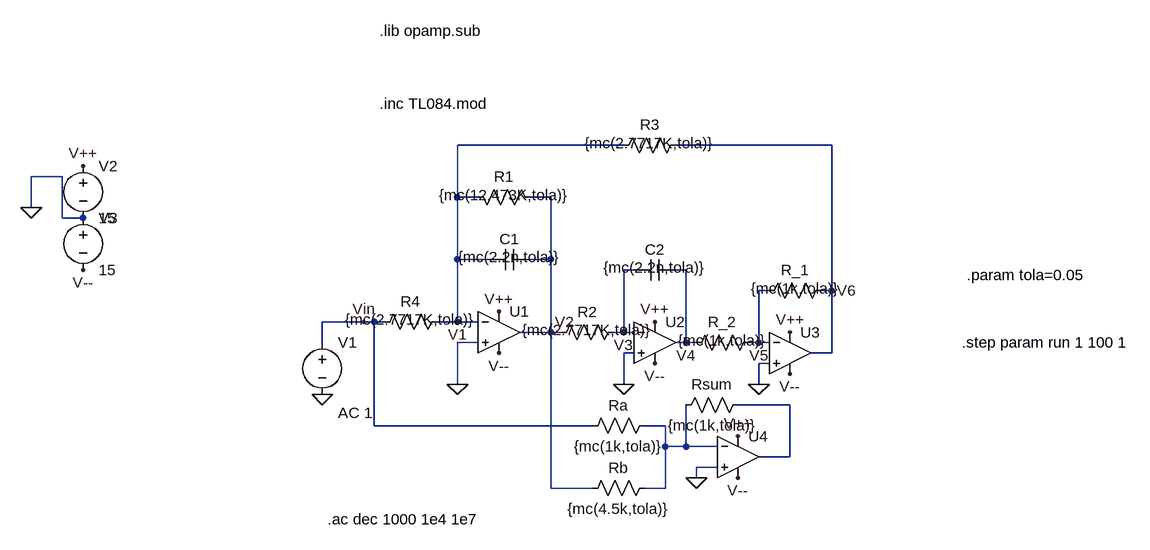
[diagram p0: schematic Tow_Thomas.asc]
Tow_Thomas.asc, the LTspice schematic file:
Version 4
SHEET 1 1092 680
WIRE 304 -64 48 -64
WIRE 624 -64 384 -64
WIRE -560 -16 -608 -16
WIRE 48 16 48 -64
WIRE 80 16 48 16
WIRE 192 16 160 16
WIRE -608 32 -608 -16
WIRE -560 48 -560 -16
WIRE -528 48 -560 48
WIRE 48 112 48 16
WIRE 96 112 48 112
WIRE 192 112 192 16
WIRE 192 112 160 112
WIRE 320 128 304 128
WIRE 400 128 384 128
WIRE 528 160 512 160
WIRE 624 160 624 -64
WIRE 624 160 608 160
WIRE -96 208 -160 208
WIRE -80 208 -96 208
WIRE -64 208 -80 208
WIRE 48 208 48 112
WIRE 48 208 16 208
WIRE 80 208 48 208
WIRE 192 224 192 112
WIRE 192 224 144 224
WIRE 208 224 192 224
WIRE 304 224 304 128
WIRE 304 224 288 224
WIRE 320 224 304 224
WIRE -160 240 -160 208
WIRE 80 240 48 240
WIRE 400 240 400 128
WIRE 400 240 384 240
WIRE 416 240 400 240
WIRE 512 240 512 160
WIRE 512 240 496 240
WIRE 528 240 512 240
WIRE 320 256 304 256
WIRE 624 256 624 160
WIRE 624 256 592 256
WIRE 528 272 512 272
WIRE 48 304 48 240
WIRE 304 304 304 256
WIRE 512 304 512 272
WIRE 560 336 480 336
WIRE -80 368 -80 208
WIRE 256 368 -80 368
WIRE 368 368 336 368
WIRE 368 400 368 368
WIRE 400 400 400 336
WIRE 400 400 368 400
WIRE 448 400 400 400
WIRE 560 416 560 336
WIRE 560 416 512 416
WIRE 448 432 416 432
WIRE 416 448 416 432
WIRE 192 464 192 224
WIRE 256 464 192 464
WIRE 368 464 368 400
WIRE 368 464 336 464
FLAG 304 304 0
FLAG 48 304 0
FLAG 512 304 0
FLAG -96 208 Vin
FLAG 48 208 V1
FLAG 192 224 V2
FLAG 304 224 V3
FLAG 400 240 V4
FLAG 512 240 V5
FLAG 624 160 V6
FLAG 416 448 0
FLAG -160 320 0
FLAG -608 32 0
FLAG -528 -32 V++
FLAG -528 128 V--
FLAG 112 256 V--
FLAG 112 192 V++
FLAG 352 272 V--
FLAG 352 208 V++
FLAG 560 288 V--
FLAG 560 224 V++
FLAG 480 448 V--
FLAG 480 384 V++
SYMBOL res 32 192 R90
WINDOW 0 0 56 VBottom 2
WINDOW 3 28 56 VBottom 2
SYMATTR InstName R4
SYMATTR Value {mc(2.7717K,tola)}
SYMBOL res 64 0 M90
WINDOW 0 0 56 VBottom 2
WINDOW 3 28 56 VBottom 2
SYMATTR InstName R1
SYMATTR Value {mc(12.473K,tola)}
SYMBOL cap 96 96 M90
WINDOW 0 0 32 VBottom 2
WINDOW 3 28 32 VBottom 2
SYMATTR InstName C1
SYMATTR Value {mc(2.2n,tola)}
SYMBOL res 304 208 R90
WINDOW 0 0 56 VBottom 2
WINDOW 3 28 56 VBottom 2
SYMATTR InstName R2
SYMATTR Value {mc(2.7717K,tola)}
SYMBOL cap 384 112 R90
WINDOW 0 0 32 VBottom 2
WINDOW 3 28 32 VBottom 2
SYMATTR InstName C2
SYMATTR Value {mc(2.2n,tola)}
SYMBOL res 512 224 R90
WINDOW 0 0 56 VBottom 2
WINDOW 3 28 56 VBottom 2
SYMATTR InstName R_2
SYMATTR Value {mc(1k,tola)}
SYMBOL res 624 144 R90
WINDOW 0 0 56 VBottom 2
WINDOW 3 28 56 VBottom 2
SYMATTR InstName R_1
SYMATTR Value {mc(1k,tola)}
SYMBOL res 400 -80 R90
WINDOW 0 0 56 VBottom 2
WINDOW 3 28 56 VBottom 2
SYMATTR InstName R3
SYMATTR Value {mc(2.7717K,tola)}
SYMBOL res 496 320 R90
WINDOW 0 0 56 VBottom 2
WINDOW 3 32 56 VTop 2
SYMATTR InstName Rsum
SYMATTR Value {mc(1k,tola)}
SYMBOL res 352 352 R90
WINDOW 0 0 56 VBottom 2
WINDOW 3 32 56 VTop 2
SYMATTR InstName Ra
SYMATTR Value {mc(1k,tola)}
SYMBOL res 352 448 R90
WINDOW 0 0 56 VBottom 2
WINDOW 3 32 56 VTop 2
SYMATTR InstName Rb
SYMATTR Value {mc(4.5k,tola)}
SYMBOL voltage -160 224 R0
WINDOW 123 24 124 Left 2
WINDOW 39 0 0 Left 2
SYMATTR Value2 AC 1
SYMATTR InstName V1
SYMATTR Value ""
SYMBOL voltage -528 -48 R0
WINDOW 123 0 0 Left 2
WINDOW 39 0 0 Left 2
SYMATTR InstName V2
SYMATTR Value 15
SYMBOL voltage -528 32 R0
WINDOW 123 0 0 Left 2
WINDOW 39 0 0 Left 2
SYMATTR InstName V3
SYMATTR Value 15
SYMBOL Opamps\\opamp2 112 160 R0
SYMATTR InstName U1
SYMATTR Value ""
SYMATTR SpiceModel TL084
SYMBOL Opamps\\opamp2 352 176 R0
SYMATTR InstName U2
SYMATTR Value ""
SYMATTR SpiceModel TL084
SYMBOL Opamps\\opamp2 560 192 R0
SYMATTR InstName U3
SYMATTR Value ""
SYMATTR SpiceModel TL084
SYMBOL Opamps\\opamp2 480 352 R0
SYMATTR InstName U4
SYMATTR Value ""
SYMATTR SpiceModel TL084
TEXT -152 512 Left 2 !.ac dec 1000 1e4 1e7
TEXT -72 -240 Left 2 !.lib opamp.sub
TEXT -72 -128 Left 2 !.inc TL084.mod
TEXT 832 136 Left 2 !.param tola=0.05
TEXT 824 240 Left 2 !.step param run 1 100 1

The netlist it stands for:
* Tow_Thomas.asc
R4 V1 Vin {mc(2.7717K,tola)}
R1 V1 V2 {mc(12.473K,tola)}
C1 V1 V2 {mc(2.2n,tola)}
R2 V3 V2 {mc(2.7717K,tola)}
C2 V4 V3 {mc(2.2n,tola)}
R_2 V5 V4 {mc(1k,tola)}
R_1 V6 V5 {mc(1k,tola)}
R3 V6 V1 {mc(2.7717K,tola)}
Rsum N001 N002 {mc(1k,tola)}
Ra N002 Vin {mc(1k,tola)}
Rb N002 V2 {mc(4.5k,tola)}
V1 Vin 0 AC 1
V2 V++ 0 15
V3 0 V-- 15
XU1 0 V1 V++ V-- V2 TL084  ; pins In+ In- V+ V- OUT
XU2 0 V3 V++ V-- V4 TL084  ; pins In+ In- V+ V- OUT
XU3 0 V5 V++ V-- V6 TL084  ; pins In+ In- V+ V- OUT
XU4 0 N002 V++ V-- N001 TL084  ; pins In+ In- V+ V- OUT
.ac dec 1000 1e4 1e7
.lib opamp.sub
.inc TL084.mod
.param tola=0.05
.step param run 1 100 1
.backanno
.end